# Altium schematic sheet 1 top.SchDoc
size A4; SheetNumber: 1; SheetTotal: 13
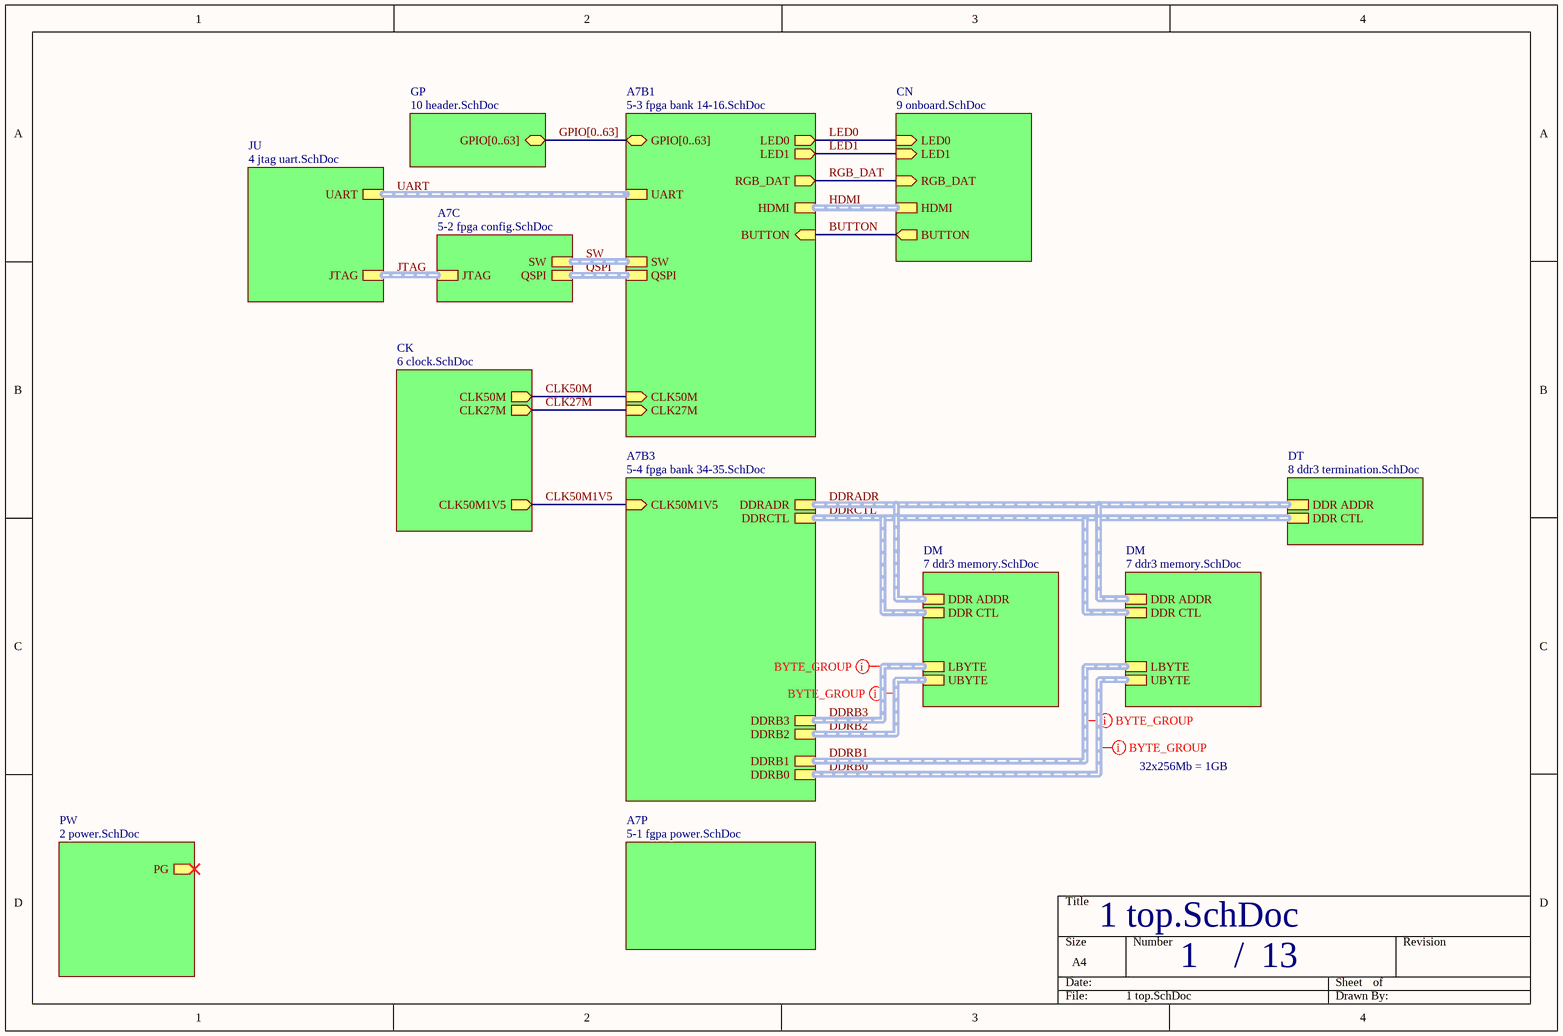
[diagram p0: 1 top.SchDoc]

## Sub-sheets
A7B1 = 5-3 fpga bank 14-16.SchDoc: CLK50M (in), CLK27M (in), UART (harness UART), QSPI (harness QSPI), SW (harness SW), HDMI (harness HDMI), RGB_DAT (out), GPIO[0..63] (bidir), BUTTON (in), LED0 (out), LED1 (out)
A7B3 = 5-4 fpga bank 34-35.SchDoc: DDRADR (harness DDR ADDR), DDRCTL (harness DDR CTL), DDRB3 (harness DDR BYTE), DDRB2 (harness DDR BYTE), DDRB1 (harness DDR BYTE), DDRB0 (harness DDR BYTE), CLK50M1V5 (in)
A7C = 5-2 fpga config.SchDoc: JTAG (harness JTAG), QSPI (harness QSPI), SW (harness SW)
A7P = 5-1 fgpa power.SchDoc: no entries
CK = 6 clock.SchDoc: CLK50M (out), CLK27M (out), CLK50M1V5 (out)
CN = 9 onboard.SchDoc: RGB_DAT (in), BUTTON (out), LED0 (in), LED1 (in), HDMI (harness HDMI)
DM = 7 ddr3 memory.SchDoc: LBYTE (harness DDR BYTE), UBYTE (harness DDR BYTE), DDR ADDR (harness DDR ADDR), DDR CTL (harness DDR CTL)
DM = 7 ddr3 memory.SchDoc: LBYTE (harness DDR BYTE), UBYTE (harness DDR BYTE), DDR ADDR (harness DDR ADDR), DDR CTL (harness DDR CTL)
DT = 8 ddr3 termination.SchDoc: DDR ADDR (harness DDR ADDR), DDR CTL (harness DDR CTL)
GP = 10 header.SchDoc: GPIO[0..63] (bidir)
JU = 4 jtag uart.SchDoc: JTAG (harness JTAG), UART (harness UART)
PW = 2 power.SchDoc: PG (out)

## Nets
BUTTON: sheet CN/BUTTON, sheet A7B1/BUTTON
CLK27M: sheet CK/CLK27M, sheet A7B1/CLK27M
CLK50M: sheet CK/CLK50M, sheet A7B1/CLK50M
CLK50M1V5: sheet CK/CLK50M1V5, sheet A7B3/CLK50M1V5
LED0: sheet CN/LED0, sheet A7B1/LED0
LED1: sheet CN/LED1, sheet A7B1/LED1
RGB_DAT: sheet CN/RGB_DAT, sheet A7B1/RGB_DAT

## Buses and harness runs
bus GPIO[0..63] = sheet A7B1/GPIO[0..63] = sheet GP/GPIO[0..63]
harness DDRADR = sheet A7B3/DDRADR = sheet DM/DDR ADDR = sheet DT/DDR ADDR
harness DDRB0 = sheet A7B3/DDRB0 = sheet DM/UBYTE
harness DDRB1 = sheet A7B3/DDRB1 = sheet DM/LBYTE
harness DDRB2 = sheet A7B3/DDRB2 = sheet DM/UBYTE
harness DDRB3 = sheet A7B3/DDRB3 = sheet DM/LBYTE
harness DDRCTL = sheet A7B3/DDRCTL = sheet DM/DDR CTL = sheet DT/DDR CTL
harness HDMI = sheet A7B1/HDMI = sheet CN/HDMI
harness JTAG = sheet A7C/JTAG = sheet JU/JTAG
harness QSPI = sheet A7B1/QSPI = sheet A7C/QSPI
harness SW = sheet A7B1/SW = sheet A7C/SW
harness UART = sheet A7B1/UART = sheet JU/UART

## Layout directives
net class BYTE_GROUP3: (no net found under the mark)
net class BYTE_GROUP2: (no net found under the mark)
net class BYTE_GROUP1: (no net found under the mark)
net class BYTE_GROUP0: (no net found under the mark)

## Notes on the sheet
- 32x256Mb = 1GB
- /